# EAGLE design LRC-0.1 (EAGLE 5.11)
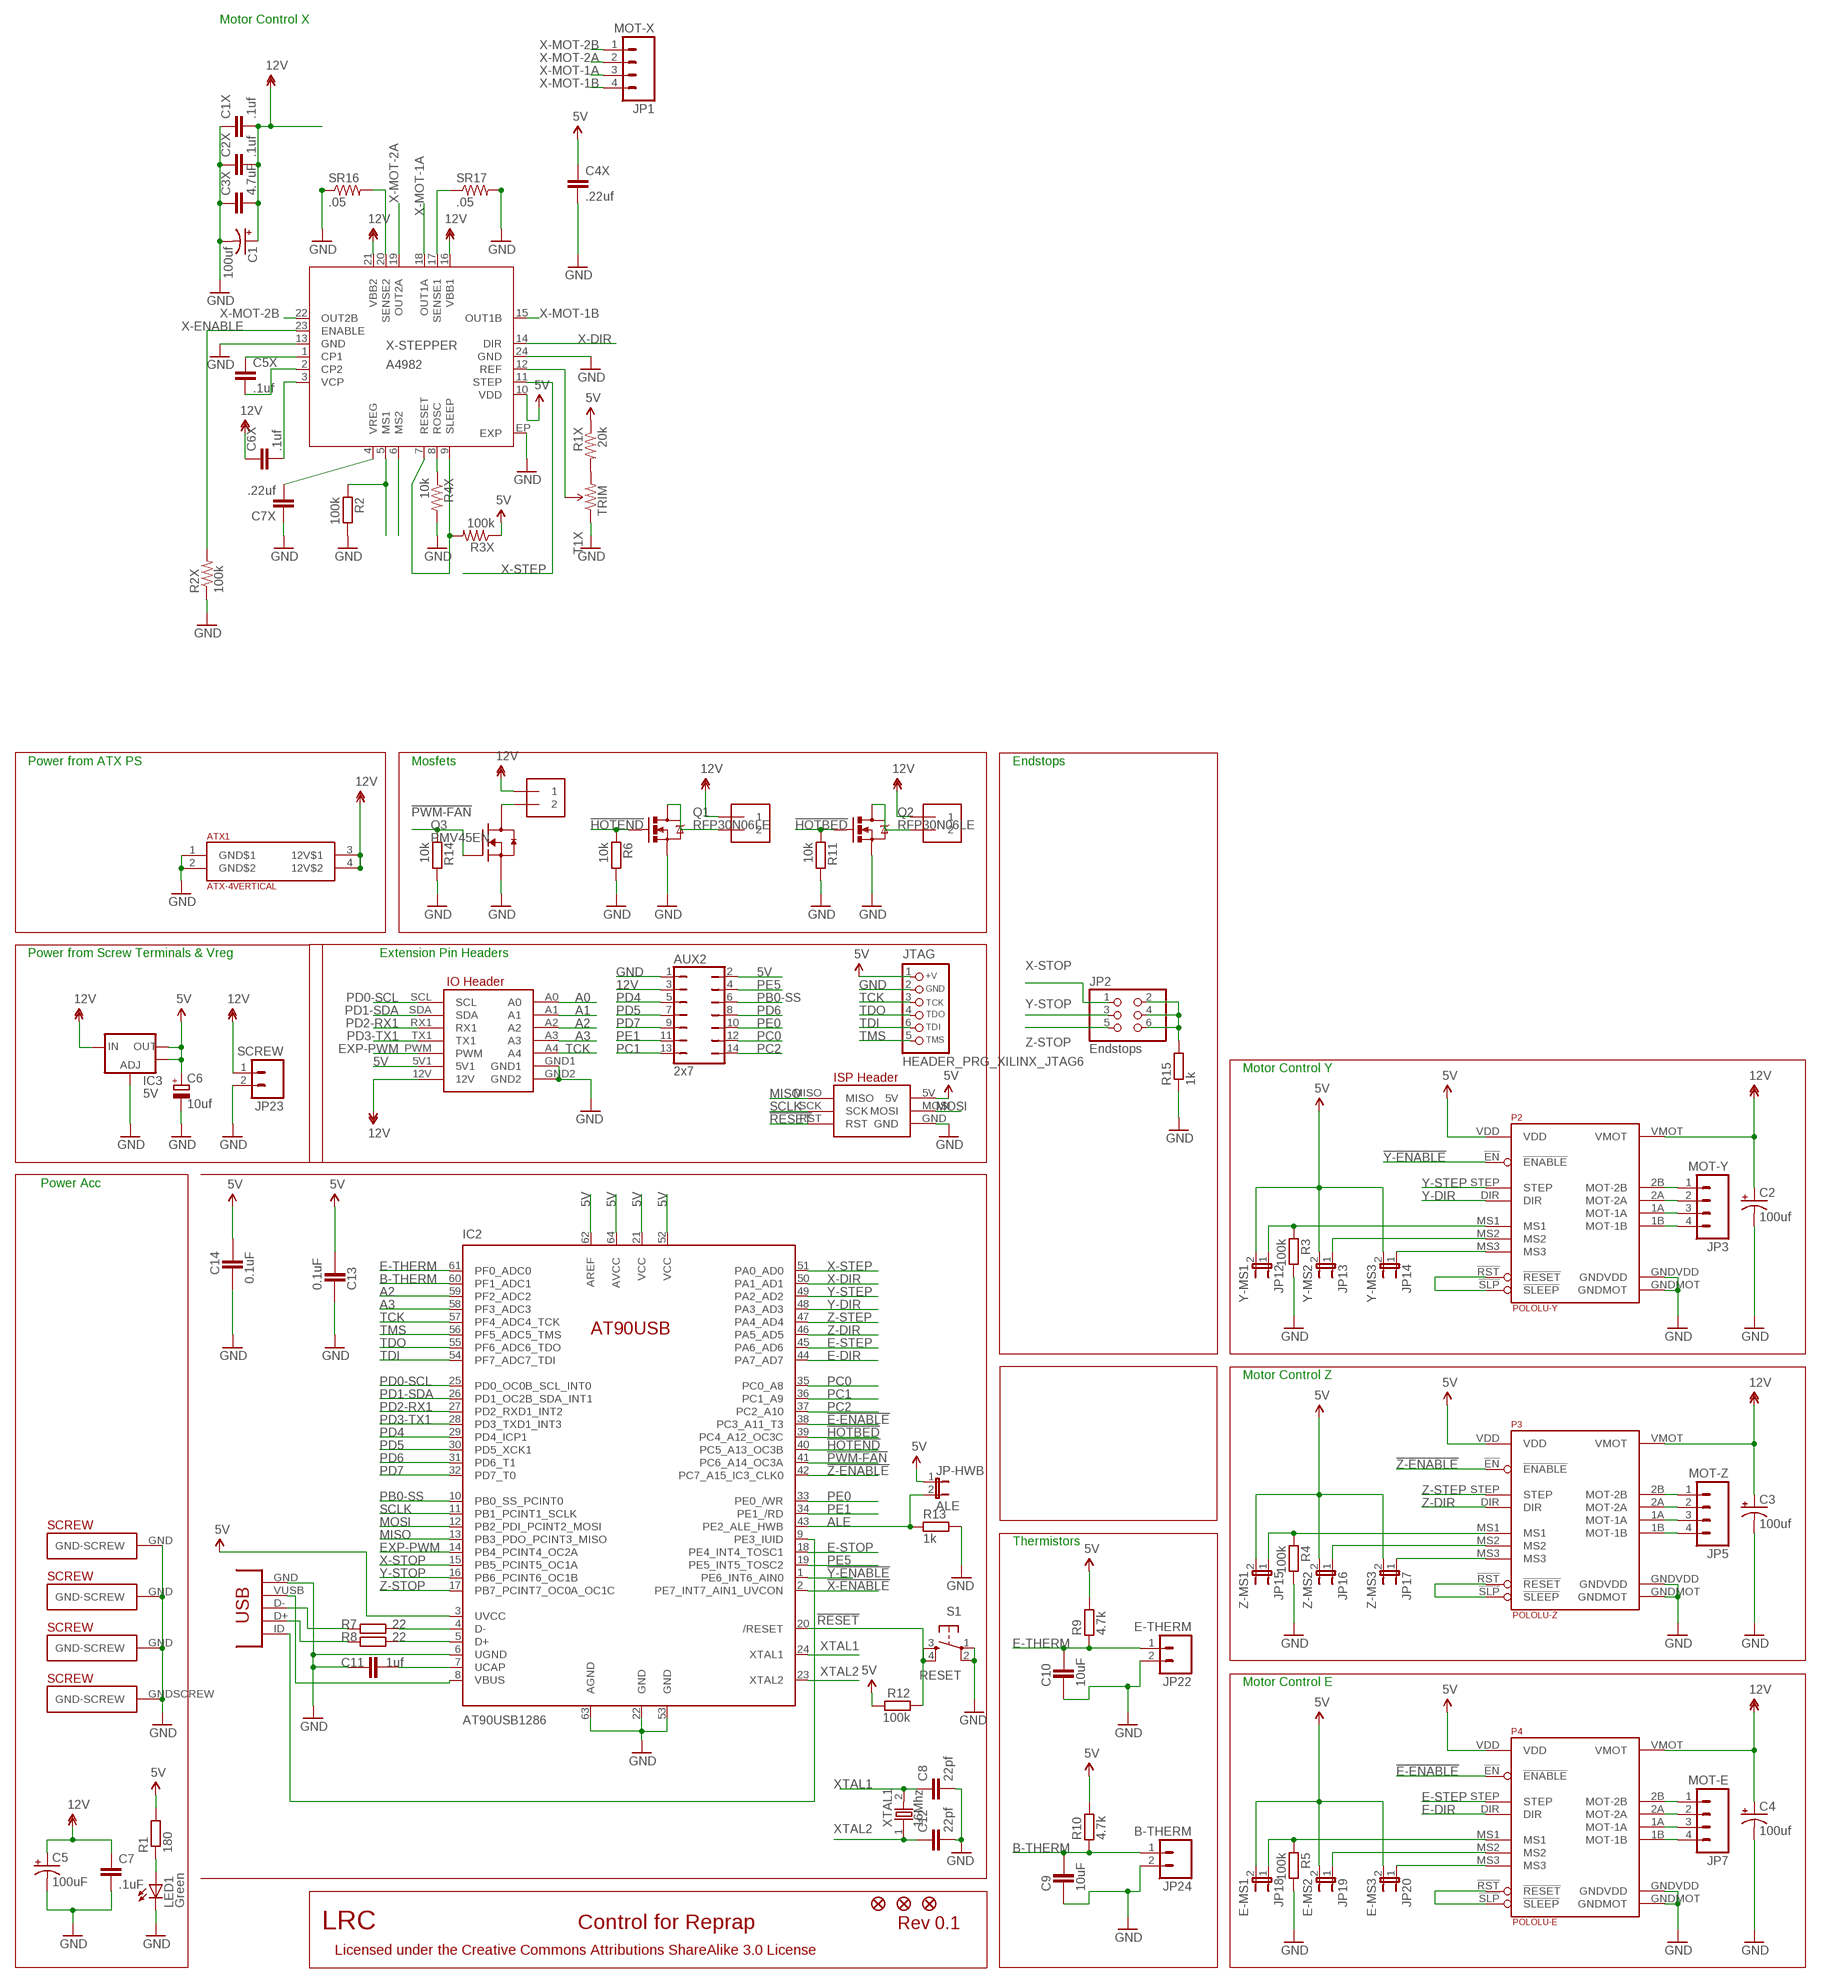
[diagram p0: schematic, sheet 1]

## Parts
ATX1  ATX-4VERTICAL  [MINIFITJR-4-VERTICAL]
AUX2  2x7  JP7Q  [JP7Q]
C1  100uf  CAP_POLPTH1  [CPOL-RADIAL-100UF-25V]
C1X  .1uf  CAP0402-CAP  [0402-CAP]
C2  100uf  CAP_POLPTH1  [CPOL-RADIAL-100UF-25V]
C2X  .1uf  CAP0402-CAP  [0402-CAP]
C3  100uf  CAP_POLPTH1  [CPOL-RADIAL-100UF-25V]
C3X  4.7uF  CAP1206  [1206]
C4  100uf  CAP_POLPTH1  [CPOL-RADIAL-100UF-25V]
C4X  .22uf  CAP0402-CAP  [0402-CAP]
C5  100uF  CAP_POLD  [PANASONIC_D]
C5X  .1uf  CAP0402-CAP  [0402-CAP]
C6  10uf  CAP_POLCASE_B  [CASE_B]
C6X  .1uf  CAP0402-CAP  [0402-CAP]
C7  .1uF  CAPC1206  [C1206]
C7X  .22uf  CAP0402-CAP  [0402-CAP]
C8  22pf  CAPC805  [C805]
C9  10uF  CAPACITOR_0805  [CAPC2012X145AN]
C10  10uF  CAPACITOR_0805  [CAPC2012X145AN]
C11  1uf  CAPACITOR_0805  [CAPC2012X145AN]
C12  22pf  CAPC805  [C805]
C13  0.1uF  CAPACITOR_0805  [CAPC2012X145AN]
C14  0.1uF  CAPACITOR_0805  [CAPC2012X145AN]
IC2  AT90USB1286  AT90USB  [TQFP64-2]
IC3  5V  V_REG_LM1117SOT223  [SOT223]
ISP  IO_HEADERS_SCREW  [IO_HEADER-PLATEDSCREW]
J1  1X2-3.5MM  [1X2-3.5MM]
J2  1X2-3.5MM  [1X2-3.5MM]
J3  1X2-3.5MM  [1X2-3.5MM]
JP1  MOT-X  M04POLAR  [MOLEX-1X4]
JP2  Endstops  PINHD-2X3  [2X03]
JP3  MOT-Y  M04POLAR  [MOLEX-1X4]
JP4  FIDUCIAL1X2.5  [FIDUCIAL-1X2.5]
JP5  MOT-Z  M04POLAR  [MOLEX-1X4]
JP7  MOT-E  M04POLAR  [MOLEX-1X4]
JP12  Y-MS1  JUMPER-2PTH  [1X02]
JP13  Y-MS2  JUMPER-2PTH  [1X02]
JP14  Y-MS3  JUMPER-2PTH  [1X02]
JP15  Z-MS1  JUMPER-2PTH  [1X02]
JP16  Z-MS2  JUMPER-2PTH  [1X02]
JP17  Z-MS3  JUMPER-2PTH  [1X02]
JP18  E-MS1  JUMPER-2PTH  [1X02]
JP19  E-MS2  JUMPER-2PTH  [1X02]
JP20  E-MS3  JUMPER-2PTH  [1X02]
JP22  E-THERM  M02PTH  [1X02]
JP23  SCREW  M025MM  [SCREWTERMINAL-5MM-2]
JP24  B-THERM  M02PTH  [1X02]
JP26  FIDUCIAL1X2.5  [FIDUCIAL-1X2.5]
JP33  FIDUCIAL1X2.5  [FIDUCIAL-1X2.5]
JP-HWB  ALE  JUMPER-2PTH  [1X02]
JTAG  HEADER_PRG_XILINX_JTAG6  [HEADER_PRG_1X06]
LED1  Green  LED805  [LED-805]
P2  POLOLU-Y  POLOLU-ALLEGRO  [POLOLU-ALLEGRO-PTH]
P3  POLOLU-Z  POLOLU-ALLEGRO  [POLOLU-ALLEGRO-PTH]
P4  POLOLU-E  POLOLU-ALLEGRO  [POLOLU-ALLEGRO-PTH]
Q1  RFP30N06LE  MOSFET-NCHANNELPTH2  [TO220V]
Q2  RFP30N06LE  MOSFET-NCHANNELPTH2  [TO220V]
Q3  PMV45EN  MOSFET-NCH_SOT-23  [SOT95P280X135-3N]
R1  180  RESISTORR805R805  [R805]
R1X  20k  RESISTOR0402-RES  [0402-RES]
R2  100k  RESISTOR_0805  [RESC2012X70N]
R2X  100k  RESISTOR0402-RES  [0402-RES]
R3  100k  RESISTOR_0805  [RESC2012X70N]
R3X  100k  RESISTOR0402-RES  [0402-RES]
R4  100k  RESISTOR_0805  [RESC2012X70N]
R4X  10k  RESISTOR0402-RES  [0402-RES]
R5  100k  RESISTOR_0805  [RESC2012X70N]
R6  10k  RESISTOR_0805  [RESC2012X70N]
R7  22  RESISTOR_0805  [RESC2012X70N]
R8  22  RESISTOR_0805  [RESC2012X70N]
R9  4.7k  RESISTOR_0805  [RESC2012X70N]
R10  4.7k  RESISTOR_0805  [RESC2012X70N]
R11  10k  RESISTOR_0805  [RESC2012X70N]
R12  100k  RESISTOR_0805  [RESC2012X70N]
R13  1k  RESISTOR_0805  [RESC2012X70N]
R14  10k  RESISTOR_0805  [RESC2012X70N]
R15  1k  RESISTORR805R805  [R805]
S1  RESET  TAC_SWITCHPTH  [TACTILE-PTH]
SR16  .05  RESISTOR1206  [1206]
SR17  .05  RESISTOR1206  [1206]
T1X  TRIM  TRIMPOTSMD  [TRIMPOT-3MM]
U$17  PLATED-SCREW  [PLATEDSCREW]
U$24  PLATED-SCREW  [PLATEDSCREW]
U$37  PLATED-SCREW  [PLATEDSCREW]
USB1  CON-USB-MINI-BUSB1  [CONN_USB_MINI-B]
X-STEPPER  A4982  [TSSOP-24]
XTAL1  16Mhz  OSC-XTAL  [HC-49U]

## Nets
5V: AUX2.2 C4X.1 C6.+ C13.2 C14.1 IC2.3(UVCC) IC2.21(VCC) IC2.52(VCC) IC2.62(AREF) IC2.64(AVCC) IC3.2(OUT) IC3.4(OUT) ISP.5V ISP.5V1 JP12.2 JP13.2 JP14.2 JP15.2 JP16.2 JP17.2 JP18.2 JP19.2 JP20.2 JP-HWB.1 JTAG.1(+V) P2.VDD P3.VDD P4.VDD R1.2 R1X.1 R3X.1 R9.2 R10.2 R12.2 X-STEPPER.10(VDD)
12V: ATX1.3(12V$1) ATX1.4(12V$2) AUX2.3 C1.1(+) C1X.2 C2.1(+) C2X.2 C3.1(+) C3X.2 C4.1(+) C5.+ C6X.1 C7.1 IC3.3(IN) ISP.12V J1.1 J2.1 J3.1 JP23.1 P2.VMOT P3.VMOT P4.VMOT X-STEPPER.16(VBB1) X-STEPPER.21(VBB2)
!E-ENABLE: IC2.38(PC3_A11_T3) P4.!EN(!ENABLE)
!HOTBED: IC2.39(PC4_A12_OC3C) Q2.1(G) R11.1
!HOTEND: IC2.40(PC5_A13_OC3B) Q1.1(G) R6.1
!PWM-FAN: IC2.41(PC6_A14_OC3A) Q3.1(G) R14.1
!RESET: IC2.20(/RESET) ISP.RST R12.1 S1.3 S1.4
!X-ENABLE: IC2.2(PE7_INT7_AIN1_UVCON)
!Y-ENABLE: IC2.1(PE6_INT6_AIN0) P2.!EN(!ENABLE)
!Z-ENABLE: IC2.42(PC7_A15_IC3_CLK0) P3.!EN(!ENABLE)
A0: ISP.A0
A1: ISP.A1
A2: IC2.59(PF2_ADC2) ISP.A2
A3: IC2.58(PF3_ADC3) ISP.A3
ALE: IC2.43(PE2_ALE_HWB) JP-HWB.2 R13.1
B-THERM: C9.2 IC2.60(PF1_ADC1) JP24.1 R10.1
E-DIR: IC2.44(PA7_AD7) P4.DIR
E-MOT-1A [power]: JP7.3 P4.1A(MOT-1A)
E-MOT-1B [power]: JP7.4 P4.1B(MOT-1B)
E-MOT-2A [power]: JP7.2 P4.2A(MOT-2A)
E-MOT-2B [power]: JP7.1 P4.2B(MOT-2B)
E-MS1: JP18.1 P4.MS1 R5.1
E-MS2: JP19.1 P4.MS2
E-MS3: JP20.1 P4.MS3
E-RESETSLEEP: P4.!RST(!RESET) P4.!SLP(!SLEEP)
E-STEP: IC2.45(PA6_AD6) P4.STEP
E-STOP: IC2.18(PE4_INT4_TOSC1)
E-THERM: C10.2 IC2.61(PF0_ADC0) JP22.1 R9.1
EXP-PWM: IC2.14(PB4_PCINT4_OC2A) ISP.PWM
GND [power]: ATX1.1(GND$1) ATX1.2(GND$2) AUX2.1 C1.2(-) C1X.1 C2.2(-) C2X.1 C3.2(-) C3X.1 C4.2(-) C4X.2 C5.- C6.- C7.2 C7X.1 C8.2 C9.1 C10.1 C12.2 C13.1 C14.2 IC2.6(UGND) IC2.22(GND) IC2.53(GND) IC2.63(AGND) IC3.1(ADJ) ISP.GND ISP.GND1 ISP.GND2 ISP.GNDSCREW(GND-SCREW) JP22.2 JP23.2 JP24.2 JTAG.2(GND) LED1.C P2.GNDMOT P2.GNDVDD P3.GNDMOT P3.GNDVDD P4.GNDMOT P4.GNDVDD Q1.3(S) Q2.3(S) Q3.2(S) R2.2 R2X.1 R3.2 R4.2 R4X.2 R5.2 R6.2 R11.2 R13.2 R14.2 R15.1 S1.1 S1.2 SR16.1 SR17.2 T1X.1(CCW) U$17.GND(GND-SCREW) U$24.GND(GND-SCREW) U$37.GND(GND-SCREW) USB1.GND X-STEPPER.13(GND) X-STEPPER.24(GND) X-STEPPER.EP(EXP)
HOTBED-GND [power]: J3.2 Q2.2(D)
HOTEND-GND [power]: J2.2 Q1.2(D)
MISO: IC2.13(PB3_PDO_PCINT3_MISO) ISP.MISO
MOSI: IC2.12(PB2_PDI_PCINT2_MOSI) ISP.MOSI
N$1: LED1.A R1.1
N$2: R8.1 USB1.D+
N$3: IC2.4(D-) R7.2
N$4: IC2.5(D+) R8.2
N$5: R7.1 USB1.D-
N$6: J1.2 Q3.3(D)
N$7: IC2.9(PE3_IUID) USB1.ID(USBID)
N$8: IC2.8(VBUS) USB1.VUSB
N$9: C11.2 IC2.7(UCAP)
N$10: JP2.2 JP2.4 JP2.6 R15.2
PB0-SS: AUX2.6 IC2.10(PB0_SS_PCINT0)
PC0: AUX2.12 IC2.35(PC0_A8)
PC1: AUX2.13 IC2.36(PC1_A9)
PC2: AUX2.14 IC2.37(PC2_A10)
PD0-SCL: IC2.25(PD0_OC0B_SCL_INT0) ISP.SCL
PD1-SDA: IC2.26(PD1_OC2B_SDA_INT1) ISP.SDA
PD2-RX1: IC2.27(PD2_RXD1_INT2) ISP.RX1
PD3-TX1: IC2.28(PD3_TXD1_INT3) ISP.TX1
PD4: AUX2.5 IC2.29(PD4_ICP1)
PD5: AUX2.7 IC2.30(PD5_XCK1)
PD6: AUX2.8 IC2.31(PD6_T1)
PD7: AUX2.9 IC2.32(PD7_T0)
PE0: AUX2.10 IC2.33(PE0_/WR)
PE1: AUX2.11 IC2.34(PE1_/RD)
PE5: AUX2.4 IC2.19(PE5_INT5_TOSC2)
SCLK: IC2.11(PB1_PCINT1_SCLK) ISP.SCK
TCK: IC2.57(PF4_ADC4_TCK) ISP.A4 JTAG.3(TCK)
TDI: IC2.54(PF7_ADC7_TDI) JTAG.6(TDI)
TDO: IC2.55(PF6_ADC6_TDO) JTAG.4(TDO)
TMS: IC2.56(PF5_ADC5_TMS) JTAG.5(TMS)
X-DIR: IC2.50(PA1_AD1) X-STEPPER.14(DIR)
X-ENABLE: R2X.2 X-STEPPER.23(ENABLE)
X-MOT-1A [power]: JP1.3 X-STEPPER.18(OUT1A)
X-MOT-1B [power]: JP1.4 X-STEPPER.15(OUT1B)
X-MOT-2A: JP1.2 X-STEPPER.19(OUT2A)
X-MOT-2B: JP1.1 X-STEPPER.22(OUT2B)
X-STEP: IC2.51(PA0_AD0) X-STEPPER.11(STEP)
X-STOP: IC2.15(PB5_PCINT5_OC1A) JP2.1
XCP1: C5X.1 X-STEPPER.1(CP1)
XCP2: C5X.2 X-STEPPER.2(CP2)
XMS1: R2.1 X-STEPPER.5(MS1)
XMS2: X-STEPPER.6(MS2)
XREF: T1X.2(WIPER) X-STEPPER.12(REF)
XREF2: R1X.2 T1X.3(CW)
XROSC: R4X.1 X-STEPPER.8(ROSC)
XSENSE1: SR17.1 X-STEPPER.17(SENSE1)
XSENSE2: SR16.2 X-STEPPER.20(SENSE2)
XSLEEP: R3X.2 X-STEPPER.7(RESET) X-STEPPER.9(SLEEP)
XTAL1: C8.1 IC2.24(XTAL1) XTAL1.2
XTAL2: C12.1 IC2.23(XTAL2) XTAL1.1
XVCP: C6X.2 X-STEPPER.3(VCP)
XVREG: C7X.2 X-STEPPER.4(VREG)
Y-DIR: IC2.48(PA3_AD3) P2.DIR
Y-MOT-1A [power]: JP3.3 P2.1A(MOT-1A)
Y-MOT-1B [power]: JP3.4 P2.1B(MOT-1B)
Y-MOT-2A [power]: JP3.2 P2.2A(MOT-2A)
Y-MOT-2B [power]: JP3.1 P2.2B(MOT-2B)
Y-MS1: JP12.1 P2.MS1 R3.1
Y-MS2: JP13.1 P2.MS2
Y-MS3: JP14.1 P2.MS3
Y-RESETSLEEP: P2.!RST(!RESET) P2.!SLP(!SLEEP)
Y-STEP: IC2.49(PA2_AD2) P2.STEP
Y-STOP: IC2.16(PB6_PCINT6_OC1B) JP2.3
Z-DIR: IC2.46(PA5_AD5) P3.DIR
Z-MOT-1A [power]: JP5.3 P3.1A(MOT-1A)
Z-MOT-1B [power]: JP5.4 P3.1B(MOT-1B)
Z-MOT-2A [power]: JP5.2 P3.2A(MOT-2A)
Z-MOT-2B [power]: JP5.1 P3.2B(MOT-2B)
Z-MS1: JP15.1 P3.MS1 R4.1
Z-MS2: JP16.1 P3.MS2
Z-MS3: JP17.1 P3.MS3
Z-RESETSLEEP: P3.!RST(!RESET) P3.!SLP(!SLEEP)
Z-STEP: IC2.47(PA4_AD4) P3.STEP
Z-STOP: IC2.17(PB7_PCINT7_OC0A_OC1C) JP2.5
Unconnected: C11.1 USB1.BODY@1(BODY) USB1.BODY@2(BODY) USB1.BODY@3(BODY) USB1.BODY@4(BODY)

## Notes on the sheet
- Motor Control X
- Power from ATX PS | Mosfets | Endstops
- Power from Screw Terminals & Vreg | Extension Pin Headers
- Motor Control Y
- Power Acc
- Motor Control Z
- Thermistors
- Motor Control E
- LRC | Control for Reprap | Rev 0.1
- Licensed under the Creative Commons Attributions ShareAlike 3.0 License

## Library data of the parts
ATX1 = atx-power-supply:ATX-4
AUX2 = jumper:JP7Q: JUMPER
C1-C5 = SparkFun:CAP_POL: Capacitor Polarized These are standard SMD and PTH capacitors. Normally 10uF, 47uF, and 100uF in electrolytic and tantalum varieties. Always verify the external diameter of the through hole cap, it varies with capacity, voltage, and manufacturer. The EIA devices should be standard.
C1X C2X C3X C4X C5X C6X C7X = SparkFun:CAP: Capacitor Standard 0603 ceramic capacitor, and 0.1" leaded capacitor.
C6 = dp_devices:CAP_POL
C7 C8 C12 = dp_devices:CAP
C9-C11 C13 C14 = ipc-7351-capacitor:CAPACITOR_
IC2 = Atmel-at90usb-teensy:AT90USB
IC3 = SparkFun:V_REG_LM1117: Voltage Regulator LM1117 Standard adjustable voltage regulator but in SMD form. Spark Fun Electronics SKU : COM-00595
ISP = Sanguinololu:IO_HEADERS_SCREW
J1-J3 = adafruit:1X2: 3.5mm Terminal block http://www.ladyada.net/library/pcb/eaglelibrary.html
JP1 JP3 JP5 JP7 = SparkFun:M04: Header 4 Standard 4-pin 0.1" header. Use with straight break away headers (SKU : PRT-00116), right angle break away headers (PRT-00553), swiss pins (PRT-00743), machine pins (PRT-00117), and female headers (PRT-00115). Molex polarized connector foot print use with SKU : PRT-08231 with associated crimp pins and housings. 1MM SMD Version SKU: PRT-10208
JP2 = SparkFun:PINHD-2X3: PIN HEADER
JP4 JP26 JP33 = SparkFun:FIDUCIAL: Fiducial Alignment Points Various fiducial points for machine vision alignment.
JP12-JP20 JP-HWB = SparkFun:JUMPER-2: Jumper Basic 0.1" spaced jumper. Use with breakaway headers.
JP22-JP24 = SparkFun:M02: Header 2 Standard 2-pin 0.1" header. Use with straight break away headers (SKU : PRT-00116), right angle break away headers (PRT-00553), swiss pins (PRT-00743), machine pins (PRT-00117), and female headers (PRT-00115). Molex polarized connector foot print use with SKU : PRT-08233 with associated crimp pins and housings.
JTAG = dp_devices:HEADER_PRG_XILINX_JTAG6: 6-pin Xilinx JTAG programming header
LED1 = dp_devices:LED
P2-P4 = pololu-allegro:POLOLU-ALLEGRO
Q1 Q2 = SparkFun:MOSFET-NCHANNEL
Q3 = ipc-7351-transistor:MOSFET-NCH_
R1 R15 = dp_devices:RESISTOR
R1X R2X R3X R4X SR16 SR17 = SparkFun:RESISTOR: Resistor Basic schematic elements and footprints for 0603, 1206, and PTH resistors.
R2-R14 = ipc-7351-resistor:RESISTOR_
S1 = SparkFun:TAC_SWITCH: Momentary Switch Button commonly used for reset or general input. Spark Fun Electronics SKU : COM-00097
T1X = SparkFun:TRIMPOT
U$17 U$24 U$37 = Sanguinololu:PLATED-SCREW
USB1 = dp_devices:CON-USB-MINI-B: USB connector
X-STEPPER = LL:A4982: A4982 stepper driver; A4982: A4982SLPTR-T
XTAL1 = dp_devices:OSC-XTAL

## Board
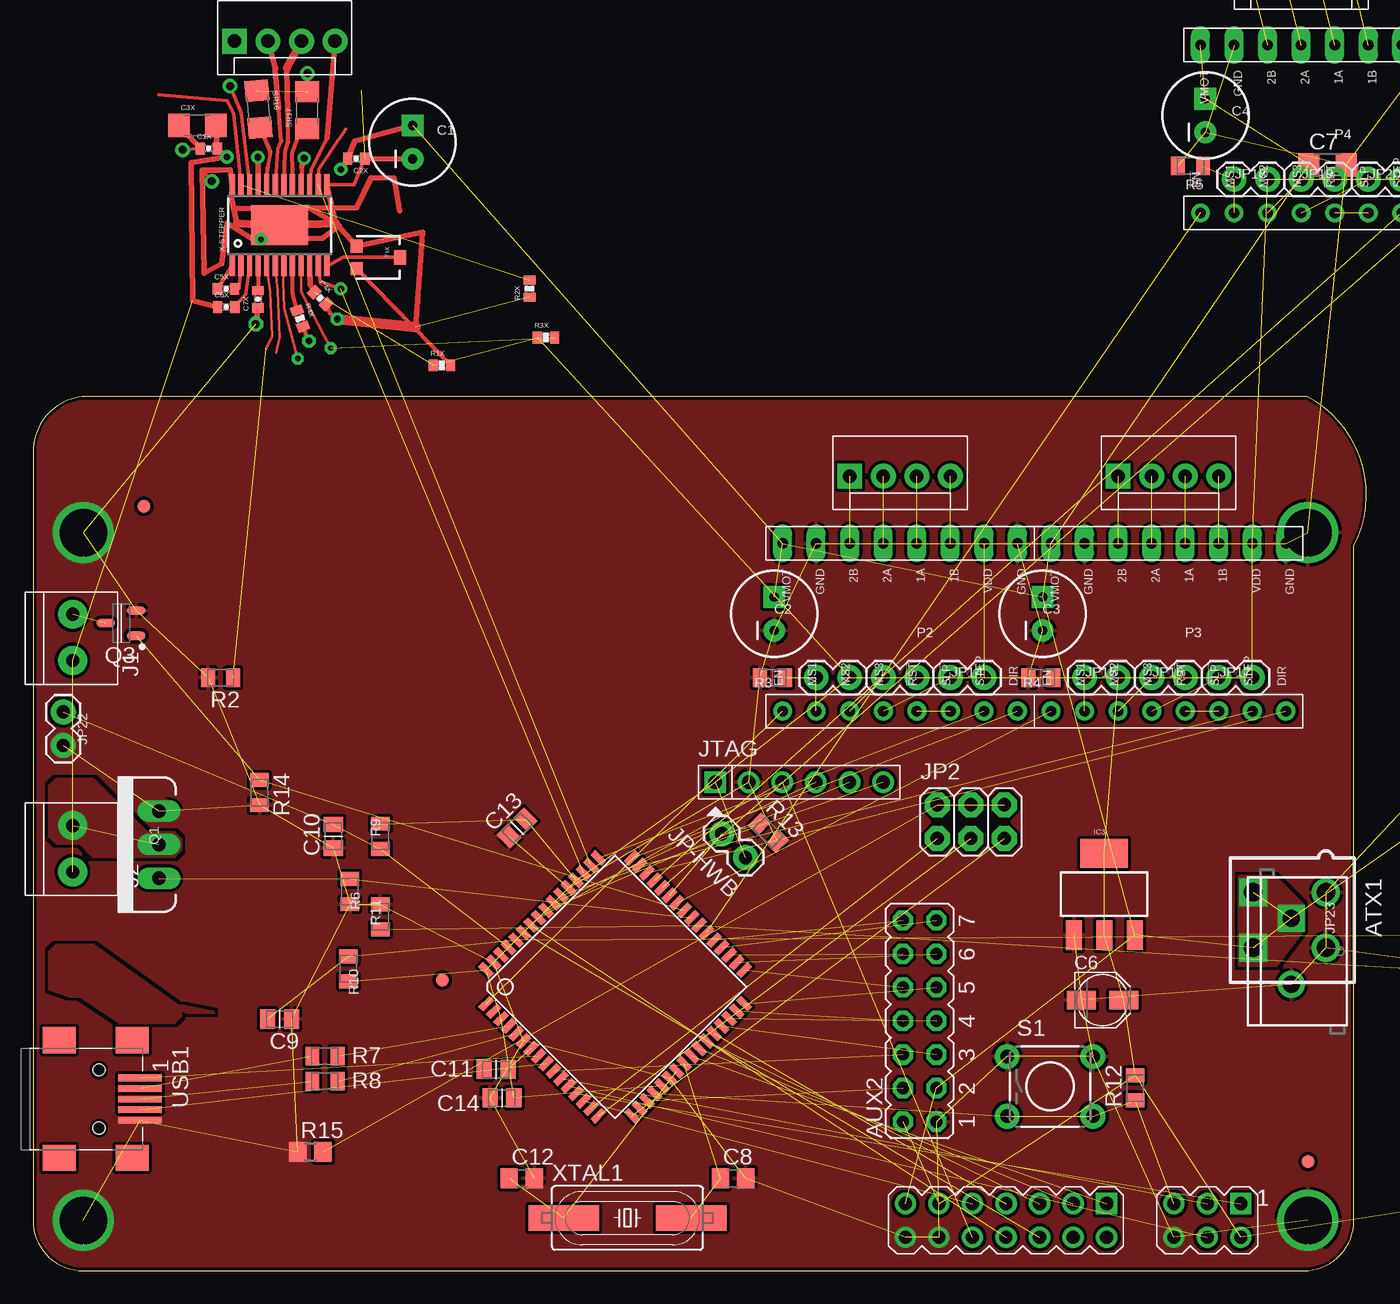
[diagram p1: board, top side]
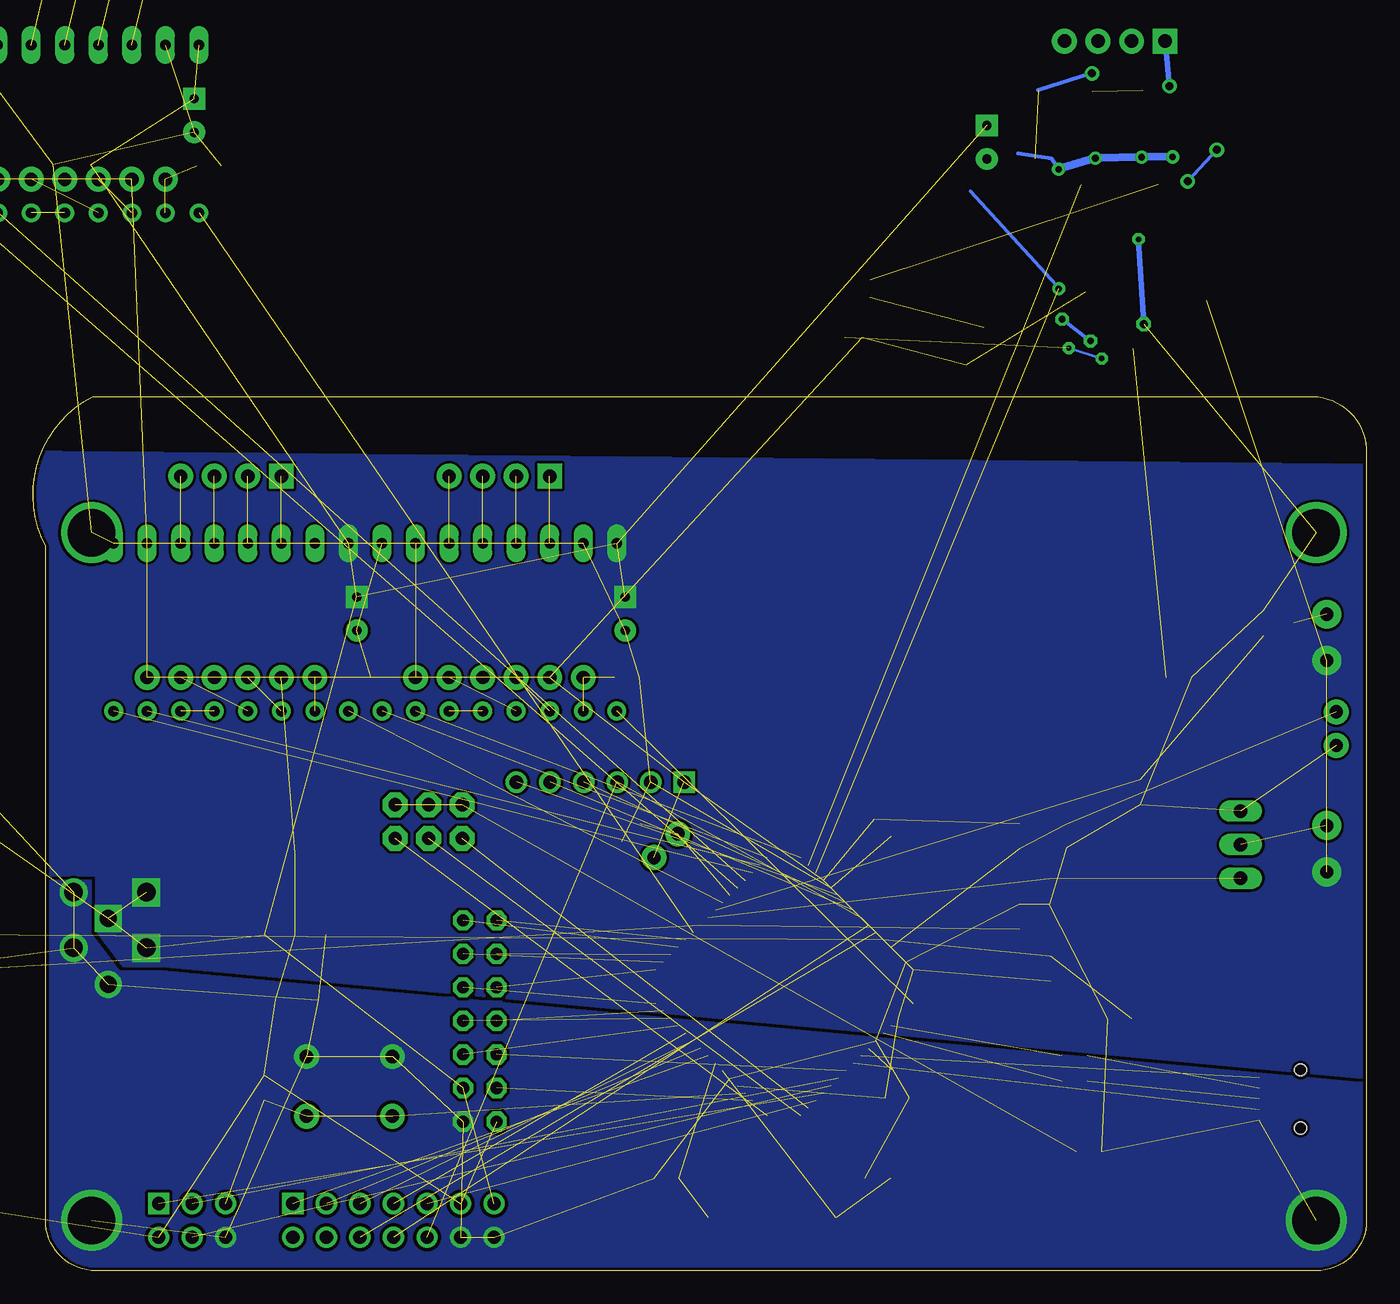
[diagram p2: board, bottom side, seen from below]

Size 100.95 x 66.19 mm. Coordinates in mm from the lower left corner, seen from the top.
Outline: 0,3.81 arc90 3.81,0 96.19,0 arc90 100,3.81 100,54.88 arc90 96.44,66.19 4.06,66.19 arc90 0,61.87 0,3.81
Copper layers (1*16): Top 0.035mm / dielectric 1.5mm / Bottom 0.035mm
Design rules "SparkFun": minimum track width 8mil, minimum drill 20mil, track to track 8mil, track to pad 8mil, pad to pad 8mil, via to via 8mil, smd to smd 8mil, copper to edge 10mil, drill to drill 8mil, minimum pad ring 12mil, minimum via ring 10mil, stop-mask expansion 4mil, vias tented up to drill 25mil, thermal gap 10mil

### Footprints (pad centres in the part's own frame; a part is rotated, then mirrored left to right if it is on the bottom)
MINIFITJR-4-VERTICAL = drill 1.4 round: 1 2.1,-2.75; 2 -2.1,-2.75 | drill 1.4 square: 3 2.1,2.75; 4 -2.1,2.75
JP7Q = drill 0.914 octagon: 1 -7.62,-1.27; 2 -7.62,1.27; 3 -5.08,-1.27; 4 -5.08,1.27; 5 -2.54,-1.27; 6 -2.54,1.27; 7 0,-1.27; 8 0,1.27; 9 2.54,-1.27; 10 2.54,1.27; 11 5.08,-1.27; 12 5.08,1.27; 13 7.62,-1.27; 14 7.62,1.27
CPOL-RADIAL-100UF-25V = drill 0.7 pad 1.651 square: 1 1.27,0 | drill 0.7 pad 1.651 round: 2 -1.27,0
0402-CAP = smd 0.7 x 0.9: 1 -0.65,0; 2 0.65,0
1206 = smd 1.6 x 1.8: 1 -1.4,0; 2 1.4,0
PANASONIC_D = smd 3 x 1.4: + 2.4,0; - -2.4,0
CASE_B = smd 2.2 x 1.4: + 1.6,0; - -1.6,0
C1206 = smd 1.6 x 1.803: 1 -1.422,0; 2 1.422,0
C805 = smd 1.3 x 1.5: 1 -0.95,0; 2 0.95,0
CAPC2012X145AN = smd 1.15 x 1.45: 1 -0.9,0; 2 0.9,0
TQFP64-2 = smd 1.194 x 0.508: 1 -7.8,6; 2 -7.8,5.2; 3 -7.8,4.4; 4 -7.8,3.6; 5 -7.8,2.8; 6 -7.8,2; 7 -7.8,1.2; 8 -7.8,0.4; 9 -7.8,-0.4; 10 -7.8,-1.2; 11 -7.8,-2; 12 -7.8,-2.8; 13 -7.8,-3.6; 14 -7.8,-4.4; 15 -7.8,-5.2; 16 -7.8,-6; 33 7.8,-6; 34 7.8,-5.2; 35 7.8,-4.4; 36 7.8,-3.6; 37 7.8,-2.8; 38 7.8,-2; 39 7.8,-1.2; 40 7.8,-0.4; 41 7.8,0.4; 42 7.8,1.2; 43 7.8,2; 44 7.8,2.8; 45 7.8,3.6; 46 7.8,4.4; 47 7.8,5.2; 48 7.8,6 | smd 0.508 x 1.194: 17 -6,-7.8; 18 -5.2,-7.8; 19 -4.4,-7.8; 20 -3.6,-7.8; 21 -2.8,-7.8; 22 -2,-7.8; 23 -1.2,-7.8; 24 -0.4,-7.8; 25 0.4,-7.8; 26 1.2,-7.8; 27 2,-7.8; 28 2.8,-7.8; 29 3.6,-7.8; 30 4.4,-7.8; 31 5.2,-7.8; 32 6,-7.8; 49 6,7.8; 50 5.2,7.8; 51 4.4,7.8; 52 3.6,7.8; 53 2.8,7.8; 54 2,7.8; 55 1.2,7.8; 56 0.4,7.8; 57 -0.4,7.8; 58 -1.2,7.8; 59 -2,7.8; 60 -2.8,7.8; 61 -3.6,7.8; 62 -4.4,7.8; 63 -5.2,7.8; 64 -6,7.8
SOT223 = smd 1.219 x 2.235: 1 -2.311,-3.099; 2 0,-3.099; 3 2.311,-3.099 | smd 3.6 x 2.2: 4 0,3.099
IO_HEADER-PLATEDSCREW = drill 1 round: 5V -5.08,-1.27; 5V1 -27.94,1.27; 12V -30.48,1.27; A0 -15.24,-1.27; A1 -17.78,-1.27; A2 -20.32,-1.27; A3 -22.86,-1.27; A4 -25.4,-1.27; GND -10.16,-1.27; GND1 -27.94,-1.27; GND2 -30.48,-1.27; MOSI -7.62,-1.27; PWM -25.4,1.27; RST -10.16,1.27; RX1 -20.32,1.27; SCK -7.62,1.27; SDA -17.78,1.27; TX1 -22.86,1.27 | drill 3.6 round: GNDSCREW 0,0 | drill 1 square: MISO -5.08,1.27; SCL -15.24,1.27
1X2-3.5MM = drill 1 pad 2.184 round: 1 1.8,0; 2 -1.7,0
MOLEX-1X4 = drill 1.016 pad 1.88 square: 1 0,0 | drill 1.016 pad 1.88 round: 2 2.54,0; 3 5.08,0; 4 7.62,0
2X03 = drill 1.016 pad 1.88 octagon: 1 -2.54,-1.27; 2 -2.54,1.27; 3 0,-1.27; 4 0,1.27; 5 2.54,-1.27; 6 2.54,1.27
FIDUCIAL-1X2.5 = smd 1 x 1: 1 0,0
1X02 = drill 1.016 pad 1.88 round: 1 0,0; 2 2.54,0
SCREWTERMINAL-5MM-2 = drill 1.3 pad 2.032 square: 1 0,0 | drill 1.3 pad 2.032 round: 2 5,0
HEADER_PRG_1X06 = drill 1.016 square: 1 -6.35,0 | drill 1.016 round: 2 -3.81,0; 3 -1.27,0; 4 1.27,0; 5 3.81,0; 6 6.35,0
LED-805 = smd 1.2 x 1.2: A 0,-1.05; C 0,1.05
POLOLU-ALLEGRO-PTH = drill 0.8 pad 1.422 long: 1A 6.35,-1.27; 1B 6.35,-3.81; 2A 6.35,1.27; 2B 6.35,3.81; GNDMOT 6.35,6.35; GNDVDD 6.35,-8.89; VDD 6.35,-6.35; VMOT 6.35,8.89 | drill 0.8 pad 1.422 round: !EN -6.35,8.89; !RST -6.35,-1.27; !SLP -6.35,-3.81; DIR -6.35,-8.89; MS1 -6.35,6.35; MS2 -6.35,3.81; MS3 -6.35,1.27; STEP -6.35,-6.35
TO220V = drill 1.016 long: 1 -2.54,0; 2 0,0; 3 2.54,0
SOT95P280X135-3N = smd 1.4 x 0.65: 1 -1.15,0.95; 2 -1.15,-0.95; 3 1.15,0
R805 = smd 1.3 x 1.5: 1 -0.95,0; 2 0.95,0
0402-RES = smd 0.7 x 0.9: 1 -0.65,0; 2 0.65,0
RESC2012X70N = smd 1.05 x 1.4: 1 -0.95,0; 2 0.95,0
TACTILE-PTH = drill 1.016 pad 1.88 round: 1 -3.251,2.261; 2 3.251,2.261; 3 -3.251,-2.261; 4 3.251,-2.261
TRIMPOT-3MM = smd 1 x 0.9: 1 -0.85,-1.65; 3 0.85,-1.65 | smd 1.1 x 0.9: 2 0,1.65
PLATEDSCREW = drill 3.6 round: GND 0,0
CONN_USB_MINI-B = smd 2 x 2.5: BODY@1 -4.45,2.5; BODY@2 4.45,2.5; BODY@3 4.45,-3; BODY@4 -4.45,-3 | smd 0.5 x 3.3: D+ 0,3.1; D- -0.8,3.1; GND 1.6,3.1; ID 0.8,3.1; VUSB -1.6,3.1 | hole 0.9: -2.2,0; 2.2,0
TSSOP-24 = smd 0.4 x 1.65: 1 -3.575,-3.05; 2 -2.925,-3.05; 3 -2.275,-3.05; 4 -1.625,-3.05; 5 -0.975,-3.05; 6 -0.325,-3.05; 7 0.325,-3.05; 8 0.975,-3.05; 9 1.625,-3.05; 10 2.275,-3.05; 11 2.925,-3.05; 12 3.575,-3.05; 13 3.575,3.05; 14 2.925,3.05; 15 2.275,3.05; 16 1.625,3.05; 17 0.975,3.05; 18 0.325,3.05; 19 -0.325,3.05; 20 -0.975,3.05; 21 -1.625,3.05; 22 -2.275,3.05; 23 -2.925,3.05; 24 -3.575,3.05 | smd 4.32 x 3: EP 0,0
HC-49U = smd 5.334 x 1.93: 1 -4.826,0; 2 4.826,0

### Placement (x,y rotation side)
ATX1  95.12,26.54 90 top
AUX2  67.12,18.91 90 top
C1  28.73,85.44 90 top  (outside the outline)
C1X  13.3,84.96 0 top  (outside the outline)
C2  56.12,49.74 90 top
C2X  24.47,84.18 180 top  (outside the outline)
C3  76.44,49.74 90 top
C3X  12.45,86.7 0 top  (outside the outline)
C4  88.75,87.45 90 top  (outside the outline)
C4X  21.74,73.63 315 top  (outside the outline)
C5  109,38 0 top  (outside the outline)
C5X  14.61,74.33 0 top  (outside the outline)
C6  80.97,20.49 0 top
C6X  14.63,72.96 0 top  (outside the outline)
C7  98,83.72 0 top  (outside the outline)
C7X  17.03,73.54 90 top  (outside the outline)
C8  53,7 0 top
C9  18.67,19.05 180 top
C10  22.73,32.89 90 top
C11  35.05,15.24 0 top
C12  37,7 0 top
C13  36.65,33.53 45 top
C14  35.51,13.08 180 top
IC2  44.07,21.5 45 top
IC3  81.09,28.51 0 top
ISP  96.52,3.81 0 top
J1  3,48 270 top
J2  3,32 270 top
J3  127,27 270 top  (outside the outline)
JP1  15.25,93.09 0 top  (outside the outline)
JP2  71,34 0 top
JP3  61.83,60.15 0 top
JP4  31,22 0 top
JP5  82.15,60.15 0 top
JP7  92.2,98.05 0 top  (outside the outline)
JP12  59.29,44.91 0 top
JP13  64.37,44.91 0 top
JP14  69.45,44.91 0 top
JP15  79.61,44.91 0 top
JP16  84.69,44.91 0 top
JP17  89.77,44.91 0 top
JP18  90.93,82.63 0 top  (outside the outline)
JP19  96.01,82.63 0 top  (outside the outline)
JP20  101.09,82.63 0 top  (outside the outline)
JP22  2.29,42.31 270 top
JP23  95.25,26.67 270 top
JP24  109.29,25.43 270 top  (outside the outline)
JP26  8.38,57.88 0 top
JP33  96.52,8.26 0 top
JP-HWB  53.94,31.28 135 top
JTAG  58,37 0 top
LED1  114,12 0 top  (outside the outline)
P2  65.64,48.72 90 top
P3  85.96,48.72 90 top
P4  97.28,86.44 90 top  (outside the outline)
Q1  9.53,32.26 90 top
Q2  116.53,24.68 90 top  (outside the outline)
Q3  6.67,49.02 180 top
R1  119,7 0 top  (outside the outline)
R1X  30.96,68.54 0 top
R2  14.21,44.91 180 top
R2X  37.58,74.35 90 top  (outside the outline)
R3  55.99,44.91 180 top
R3X  38.83,70.65 0 top  (outside the outline)
R4  76.31,44.91 180 top
R4X  20.21,72.09 290 top  (outside the outline)
R5  87.62,83.63 180 top  (outside the outline)
R6  24,28.7 270 top
R7  22.1,16.26 0 top
R8  22.1,14.35 0 top
R9  26.29,32.89 90 top
R10  23.88,22.86 270 top
R11  26.29,26.8 90 top
R12  83.44,13.84 90 top
R13  55.67,33.16 315 top
R14  17.14,36.2 270 top
R15  21,9 0 top
S1  77,13.95 0 top
SR16  17.07,87.93 275 top  (outside the outline)
SR17  20.75,87.86 90 top  (outside the outline)
T1X  26.15,76.72 270 top  (outside the outline)
U$17  3.81,3.81 0 top
U$24  96.52,55.88 0 top
U$37  3.81,55.88 0 top
USB1  5,13 270 top
X-STEPPER  18.67,79.16 0 top  (outside the outline)
XTAL1  45,4 0 top

### Tracks (layer width: path | path; a pad name or v marks a point on that pad's centre or on a via)
5V  (33 unrouted)
  Top 0.406: X-STEPPER.10 20.98,74.65 C4X.1
12V  (via drill 0.5)  (17 unrouted)
  Top 0.305: 20.34,83.54 X-STEPPER.16
  Top 0.406: C6X.1 12.09,73.43 11.96,83.87 v14.68,84.33 C1X.2 C3X.2 | v17.02,84.3 17.05,84.15 X-STEPPER.21 | v20.52,84.23 20.34,83.54 | v23.32,83.39 C2X.2 24.36,85.5 C1.1
  Bottom 0.305: 26.36,84.58 C2X.2 v23.32,83.39
  Bottom 0.61: v14.68,84.33 v17.02,84.3 v20.52,84.23 v23.32,83.39
  pour Bottom (no thermals): -1.27,14.48 91.31,23.11 94.11,23.11 96.14,25.78 96.14,29.97 101.73,29.97 102.6,61.96 -1.27,60.96
  pour Top (no thermals): 96.14,25.78 94.11,23.11 91.31,23.11 91.31,29.84 93.98,29.84 96.14,27.69
!E-ENABLE  (1 unrouted)
!HOTBED  (2 unrouted)
!HOTEND  (2 unrouted)
!PWM-FAN  (2 unrouted)
!RESET  (4 unrouted)
!Y-ENABLE  (1 unrouted)
!Z-ENABLE  (1 unrouted)
A2  (1 unrouted)
A3  (1 unrouted)
ALE  (2 unrouted)
B-THERM  (3 unrouted)
E-DIR  (1 unrouted)
E-MOT-1A  (1 unrouted)
E-MOT-1B  (1 unrouted)
E-MOT-2A  (1 unrouted)
E-MOT-2B  (1 unrouted)
E-MS1  (2 unrouted)
E-MS2  (1 unrouted)
E-MS3  (1 unrouted)
E-RESETSLEEP  (1 unrouted)
E-STEP  (1 unrouted)
E-THERM  (3 unrouted)
EXP-PWM  (1 unrouted)
GND  (via drill 0.41, 0.5, 0.6)  (56 unrouted)
  Top 0.254: C2X.1 24.31,82.22 X-STEPPER.13 | 12.8,83.31 v13.54,82.47 | v11.33,84.86 C1X.1
  Top 0.305: C4X.2 22.48,72.49 v23.03,72.04 | SR17.2 v20.78,90.65 | v20.88,70.38 R4X.2
  Top 0.406: X-STEPPER.13 22.91,79.32 T1X.1 29.49,78.64 28.98,71.42 | 15.42,79.3 15.04,81.18 X-STEPPER.24 14.91,83.36 14.07,83.31 12.8,83.31 12.95,75.51 14.3,76.25 14.71,79.3 16.64,78.08 v17.25,78.09 17.48,78.09 21.92,78.16 23.19,79.12 20.83,80.52 15.24,80.42 24.51,80.49 25.6,82.75 27.33,82.7 27.74,80.24 | C7X.1 v16.87,71.68 | C1X.1 12.37,85.32 C3X.1 | C2X.1 C1.2
  Top 0.61: 15.42,79.3 X-STEPPER.EP 22.91,79.32
  Top 0.813: 28.98,71.42 v23.03,72.04
  Bottom 0.254: v13.54,82.47 v11.33,84.86
  Bottom 0.305: v20.78,90.65 24.84,89.38 | v23.03,72.04 v20.88,70.38
  Bottom 0.406: v16.87,71.68 v17.25,78.09
  pour Top (isolate 0.254, rank 6): -6.35,66.04 106.68,66.04 106.68,-2.54 -6.35,-2.54
  pour Bottom (isolate 0.254, rank 6, no thermals): -5.08,64.77 106.41,65.77 105.41,-1.27 -5.08,-1.27
  pour Top (isolate 0.254, rank 2, no thermals): 90.42,5.6 23.88,6.6 23.88,0.25 100.08,0.25
  pour Top (isolate 0.254, rank 2, no thermals): -0.25,59.69 -0.25,-0.51 23.37,-0.51 23.37,12.7 14.22,12.7 14.22,23.37 21.34,23.37 21.34,32.26 14.99,32.26 6.86,37.85 6.86,59.69
HOTBED-GND  (1 unrouted)
  pour Top (no thermals): 1.27,24.13 1.27,21.32 2.78,20.81 3.56,20.81 6.57,18.8 10.67,18.8 11.18,19.3 11.18,20.07 13.67,19.57 11.64,19.57 4.57,24.64 1.78,24.64
HOTEND-GND  (1 unrouted)
  pour Top (no thermals): 1.27,36.2 1.27,33.4 1.27,33.15 1.27,32.89 1.78,32.38 3.3,32.38 3.56,32.38 4.57,31.37 10.67,31.37 11.18,31.88 11.18,32.64 10.67,33.15 8.64,33.15 4.57,37.21 1.78,37.21 1.27,36.7
MISO  (1 unrouted)
MOSI  (1 unrouted)
N$1  (1 unrouted)
N$2  (1 unrouted)
N$3  (1 unrouted)
N$4  (1 unrouted)
N$5  (1 unrouted)
N$6  (1 unrouted)
N$7  (1 unrouted)
N$8  (1 unrouted)
N$9  (1 unrouted)
N$10  (3 unrouted)
PB0-SS  (1 unrouted)
PC0  (1 unrouted)
PC1  (1 unrouted)
PC2  (1 unrouted)
PD0-SCL  (1 unrouted)
PD1-SDA  (1 unrouted)
PD2-RX1  (1 unrouted)
PD3-TX1  (1 unrouted)
PD4  (1 unrouted)
PD5  (1 unrouted)
PD6  (1 unrouted)
PD7  (1 unrouted)
PE0  (1 unrouted)
PE1  (1 unrouted)
PE5  (1 unrouted)
SCLK  (1 unrouted)
TCK  (2 unrouted)
TDI  (1 unrouted)
TDO  (1 unrouted)
TMS  (1 unrouted)
X-DIR  (1 unrouted)
  Top 0.254: X-STEPPER.14 21.64,83.39 23.67,86.44
X-ENABLE  (1 unrouted)
  Top 0.254: X-STEPPER.23 15.19,87.61 14.68,88.59 9.53,89.03
X-MOT-1A
  Top 0.305: X-STEPPER.18 19.07,84.71 19.33,85.47 19.28,87.71
  Top 0.406: 19.2,91.03 19.28,87.71
  Top 0.61: 19.2,91.03 JP1.3
X-MOT-1B
  Top 0.254: X-STEPPER.15 21.06,83.31 22.25,85.78
  Top 0.406: 22.25,85.78 JP1.4
X-MOT-2A
  Top 0.254: X-STEPPER.19 18.44,83.64 18.52,84.91 18.8,85.52
  Top 0.305: 18.8,85.52 18.59,87.96
  Top 0.406: 18.3,91.23 18.36,90.98 | 18.3,91.23 JP1.2 | 18.59,87.96 18.3,91.23
X-MOT-2B  (via drill 0.6)
  Top 0.254: X-STEPPER.22 15.75,87.68 v14.91,89.69
  Bottom 0.406: v14.91,89.69 JP1.1
X-STEP  (via drill 0.5)  (1 unrouted)
  Top 0.254: X-STEPPER.11 21.74,74.88 v23.29,74.35
  Bottom 0.254: v23.29,74.35 23.5,74.62 29.97,81.71
X-STOP  (1 unrouted)
XCP1
  Top 0.254: C5X.1 X-STEPPER.1
XCP2
  Top 0.254: X-STEPPER.2 15.62,74.4 C5X.2
XMS1  (1 unrouted)
  Top 0.203: X-STEPPER.5 17.96,74.09 18.09,70.76 17.65,69.8
XMS2
  Top 0.203: X-STEPPER.6 18.52,74.17 18.67,70.69 18.41,69.52
XREF
  Top 0.254: T1X.2 23.47,76.73 22.36,76.11 X-STEPPER.12
XREF2
  Top 0.305: R1X.2 T1X.3
XROSC
  Top 0.305: R4X.1 19.66,73.99 X-STEPPER.8
XSENSE1
  Top 0.254: SR17.1 20.62,86.39 20.02,85.75
  Top 0.305: 20.02,85.75 19.63,84.56 19.66,83.39 X-STEPPER.17
XSENSE2
  Top 0.254: 17.78,83.54 17.98,84.68
  Top 0.305: X-STEPPER.20 17.78,83.54 | 17.98,84.68 SR16.2
XSLEEP  (via drill 0.41)  (1 unrouted)
  Top 0.203: v22.53,69.85 20.3,74.14 X-STEPPER.9 | v20.04,69.06 19.02,72.87 18.95,74.83 X-STEPPER.7
  Bottom 0.203: v20.04,69.06 v22.53,69.85
XTAL1  (2 unrouted)
XTAL2  (2 unrouted)
XVCP
  Top 0.254: X-STEPPER.3 16.22,74.7 16.1,73.94 C6X.2
XVREG
  Top 0.305: X-STEPPER.4 C7X.2
Y-DIR  (1 unrouted)
Y-MOT-1A  (1 unrouted)
Y-MOT-1B  (1 unrouted)
Y-MOT-2A  (1 unrouted)
Y-MOT-2B  (1 unrouted)
Y-MS1  (2 unrouted)
Y-MS2  (1 unrouted)
Y-MS3  (1 unrouted)
Y-RESETSLEEP  (1 unrouted)
Y-STEP  (1 unrouted)
Y-STOP  (1 unrouted)
Z-DIR  (1 unrouted)
Z-MOT-1A  (1 unrouted)
Z-MOT-1B  (1 unrouted)
Z-MOT-2A  (1 unrouted)
Z-MOT-2B  (1 unrouted)
Z-MS1  (2 unrouted)
Z-MS2  (1 unrouted)
Z-MS3  (1 unrouted)
Z-RESETSLEEP  (1 unrouted)
Z-STEP  (1 unrouted)
Z-STOP  (1 unrouted)

### Text on the board
_tsilk: X-MOTOR | 12V PWR | Y-MOTOR | 12V PWR | Z-MOTOR | 12V PWR | E-MOTOR | 2B | 2A | 1A | 1B | GND | +12V | 2B | 2A | 1A | 1B | GND | +12V | 2B | 2A | 1A | 1B | GND | +12V | 2B | 2A | 1A | 1B | FAN | C5 | Q3 | Extruder | C1 | C2 | C3 | C4 | +12V | Therm. | MS1 | MS2 | MS3 | MS1 | MS2 | MS3 | MS1 | MS2 | MS3 | MS1 | MS2 | MS3 | R2 | R3 | R4 | R5 | LM7805 | Hot End | R14 | Extruder | X-Axis | Y-Axis | Z-Axis | -V | - | + | C6 | C10 | R9 | R13 | R1 | C13 | C16 | ATX+4 | +12V | R6 | ALE | POWER LED | Q1 | R11 | 12V | GND | Bed | C12 | C7 | -V | R10 | GND | SCREW | +12V | C9 | R7 | C11 | RESET | Q2 | R12 | Hot Bed | Therm. | R8 | S1 | 12V | Endstop Voltage | 5V | C14 | ver 0.7 | Teensylu | reprap.org/wiki/Teensylu | PWM | TX1 | RX1 | SDA | SCL | E-STOP | GND | +V | SIG | X-STOP | GND | +V | SIG | Y-STOP | GND | +V | SIG | Z-STOP | GND | +V | SIG | 12V | 5V | D12 | D11 | D10 | D17 | D16 | !RESET | SCK | MISO | ISP/SPI | GND | GND | A4 | A3 | A2 | A1 | A0 | GND | MOSI | 5V